# EAGLE schematic xytheta (EAGLE 9.6.2)
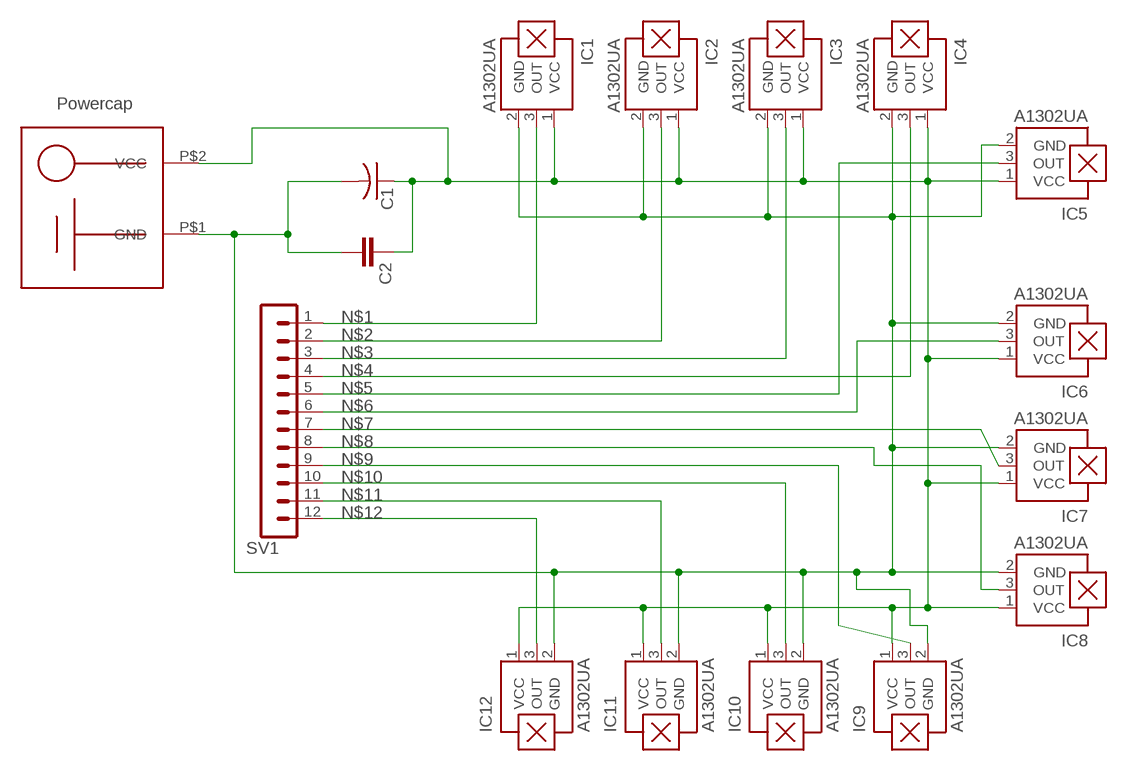
[diagram p0: schematic, sheet 1]

## Parts
C1  C-US025-050X050  [C025-050X050]
C2  C-EU025-025X050  [C025-025X050]
IC1  A1302UA  [SIP3-UA]
IC2  A1302UA  [SIP3-UA]
IC3  A1302UA  [SIP3-UA]
IC4  A1302UA  [SIP3-UA]
IC5  A1302UA  [SIP3-UA]
IC6  A1302UA  [SIP3-UA]
IC7  A1302UA  [SIP3-UA]
IC8  A1302UA  [SIP3-UA]
IC9  A1302UA  [SIP3-UA]
IC10  A1302UA  [SIP3-UA]
IC11  A1302UA  [SIP3-UA]
IC12  A1302UA  [SIP3-UA]
SV1  MA12-1  [MA12-1]
U$1  POWERCAP  [POWERCAP]

## Nets
N$1: IC1.3(OUT) SV1.1
N$2: IC2.3(OUT) SV1.2
N$3: IC3.3(OUT) SV1.3
N$4: IC4.3(OUT) SV1.4
N$5: IC5.3(OUT) SV1.5
N$6: IC6.3(OUT) SV1.6
N$7: IC7.3(OUT) SV1.7
N$8: IC8.3(OUT) SV1.8
N$9: IC9.3(OUT) SV1.9
N$10: IC10.3(OUT) SV1.10
N$11: IC11.3(OUT) SV1.11
N$12: IC12.3(OUT) SV1.12
N$14: C1.1 C2.1 IC1.1(VCC) IC2.1(VCC) IC3.1(VCC) IC4.1(VCC) IC5.1(VCC) IC6.1(VCC) IC7.1(VCC) IC8.1(VCC) IC9.1(VCC) IC10.1(VCC) IC11.1(VCC) IC12.1(VCC) U$1.P$2(VCC)
N$15: C1.2 C2.2 IC1.2(GND) IC2.2(GND) IC3.2(GND) IC4.2(GND) IC5.2(GND) IC6.2(GND) IC7.2(GND) IC8.2(GND) IC9.2(GND) IC10.2(GND) IC11.2(GND) IC12.2(GND) U$1.P$1(GND)

## Library data of the parts
C1 = rcl:C-US: CAPACITOR, American symbol; SPICEPREFIX: C
C2 = rcl:C-EU: CAPACITOR, European symbol; SPICEPREFIX: C
IC1-IC12 = allegro_custom:A13*?: Linear Hall Effect Sensor ICs Continuous-Time Ratiometric High-Temperature Operation Programmable Linear with Analog Output A1302 -Replacement- UGN3503 Source: http://www.allegromicro.com/en/Products/Part_Numbers/1301/1301.pdf http://www.allegromicro.com/en/Products/Part_Numbers/1321/1321.pdf http://www.allegromicro.com/en/Products/Part_Numbers/1381/1381.pdf; MF: ALLEGRO MICROSYSTEMS, INC.; MPN: A1302EUA-T; OC_FARNELL: 1521708; OC_NEWARK: 31K6639
SV1 = con-lstb:MA12-1: PIN HEADER; OC_FARNELL: unknown; OC_NEWARK: unknown
U$1 = Powercap:POWERCAP